# Altium schematic sheet Dsub.SchDoc
size B
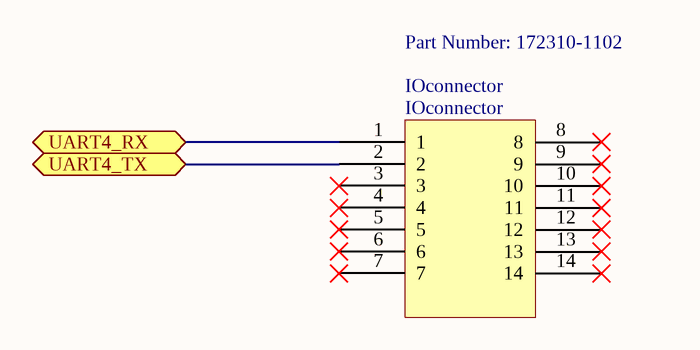
[diagram p0: Dsub.SchDoc]

## Parts
IOconnector  IOconnector  [MICRODSUB]

## Ports
UART4_RX (bidir), UART4_TX (bidir)

## Nets
UART4_RX: IOconnector.1 ; port UART4_RX
UART4_TX: IOconnector.2 ; port UART4_TX

Not connected (* = marked no-connect by the designer): IOconnector 3* 4* 5* 6* 7* 8* 9* 10* 11* 12* 13* 14*

## Notes on the sheet
- Part Number: 172310-1102

## Library data of the parts
IOconnector = MicroDSub: 12226-5150-00FR